# EasyEDA schematic Arduino SST39SF040 Programmer Shield_2020-08-30_18-59-34.json
TITLE: Arduino SST39SF040 Programmer; REV: 1.0; Date: 2020-03-09; Sheet: 1/1; Drawn By: dean.netherton; Company: Dean Netherton
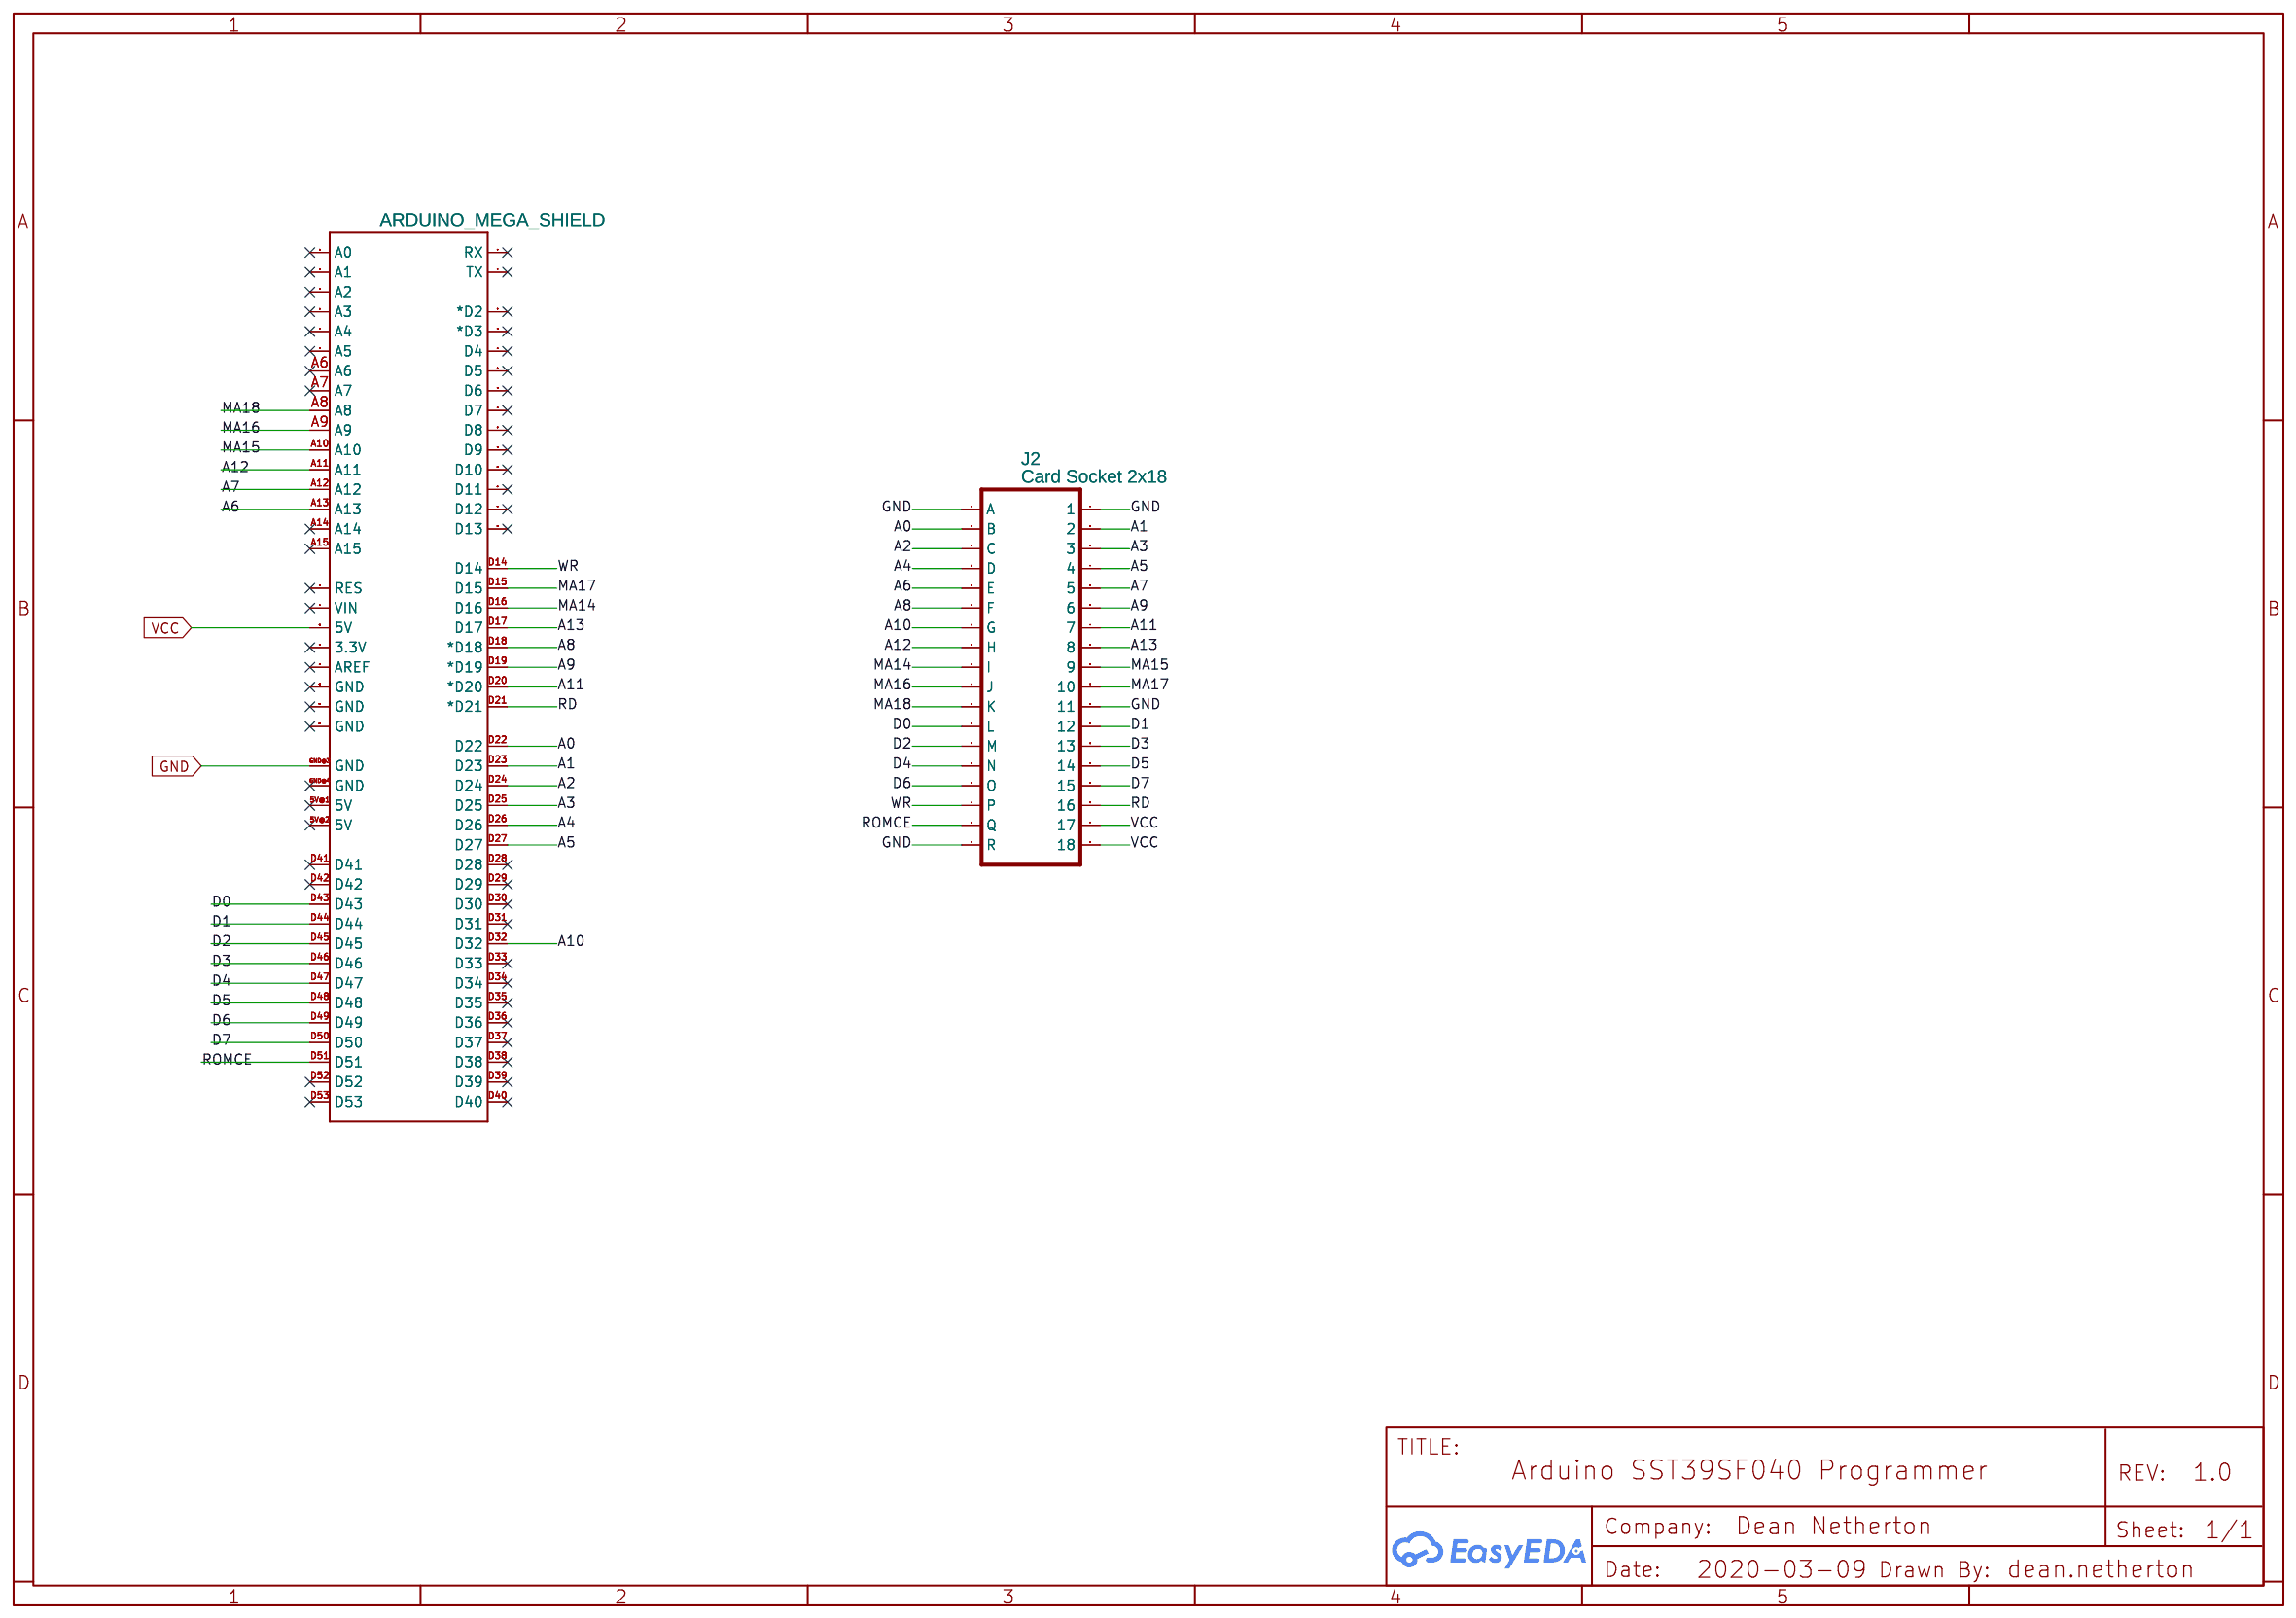
[diagram p0: schematic sheet]

## Parts
J2  Card Socket 2x18  [CARD_EDGE_CONNECTOR_.156_18X2_PIN]
U2  ARDUINO_MEGA_SHIELD  [ARDUINO_MEGA_SHIELD]

## Library data of the parts
J2 = Card Socket 2x18: sourceId: 90wOI0Oa8; Contributor: Dean Netherton
U2 = ARDUINO_MEGA_SHIELD: Package Display: No

## Nets
GND: J2.1 J2.11 J2.A J2.V(R) U2.GND@3(GND)
VCC: J2.17 J2.18 U2.5V@0(5V)
A0: J2.B U2.D22
A1: J2.2 U2.D23
A2: J2.C U2.D24
A3: J2.3 U2.D25
A4: J2.D U2.D26
A5: J2.4 U2.D27
A6: J2.E U2.A13
A7: J2.5 U2.A12
A8: J2.F U2.D18(*D18)
A9: J2.6 U2.D19(*D19)
A10: J2.H(G) U2.D32
A11: J2.7 U2.D20(*D20)
A12: J2.J(H) U2.A11
A13: J2.8 U2.D17
D0: J2.N(L) U2.D43
D1: J2.12 U2.D44
D2: J2.P(M) U2.D45
D3: J2.13 U2.D46
D4: J2.R(N) U2.D47
D5: J2.14 U2.D48
D6: J2.S(O) U2.D49
D7: J2.15 U2.D50
MA14: J2.K(I) U2.D16
MA15: J2.9 U2.A10
MA16: J2.L(J) U2.A9
MA17: J2.10 U2.D15
MA18: J2.M(K) U2.A8
RD: J2.16 U2.D21(*D21)
ROMCE: J2.U(Q) U2.D51
WR: J2.T(P) U2.D14

Not connected (* = marked no-connect by the designer): U2 3.3V* 5V@1(5V)* 5V@2(5V)* A0* A1* A2* A3* A4* A5* A6* A7* A14* A15* AREF* D2(*D2)* D3(*D3)* D4* D5* D6* D7* D8* D9* D10* D11* D12* D13* D28* D29* D30* D31* D33* D34* D35* D36* D37* D38* D39* D40* D41* D42* D52* D53* GND@0(GND)* GND@1(GND)* GND@2(GND)* GND@4(GND)* RES* RX* TX* VIN*
